# EAGLE design probe (EAGLE 9.6.2)
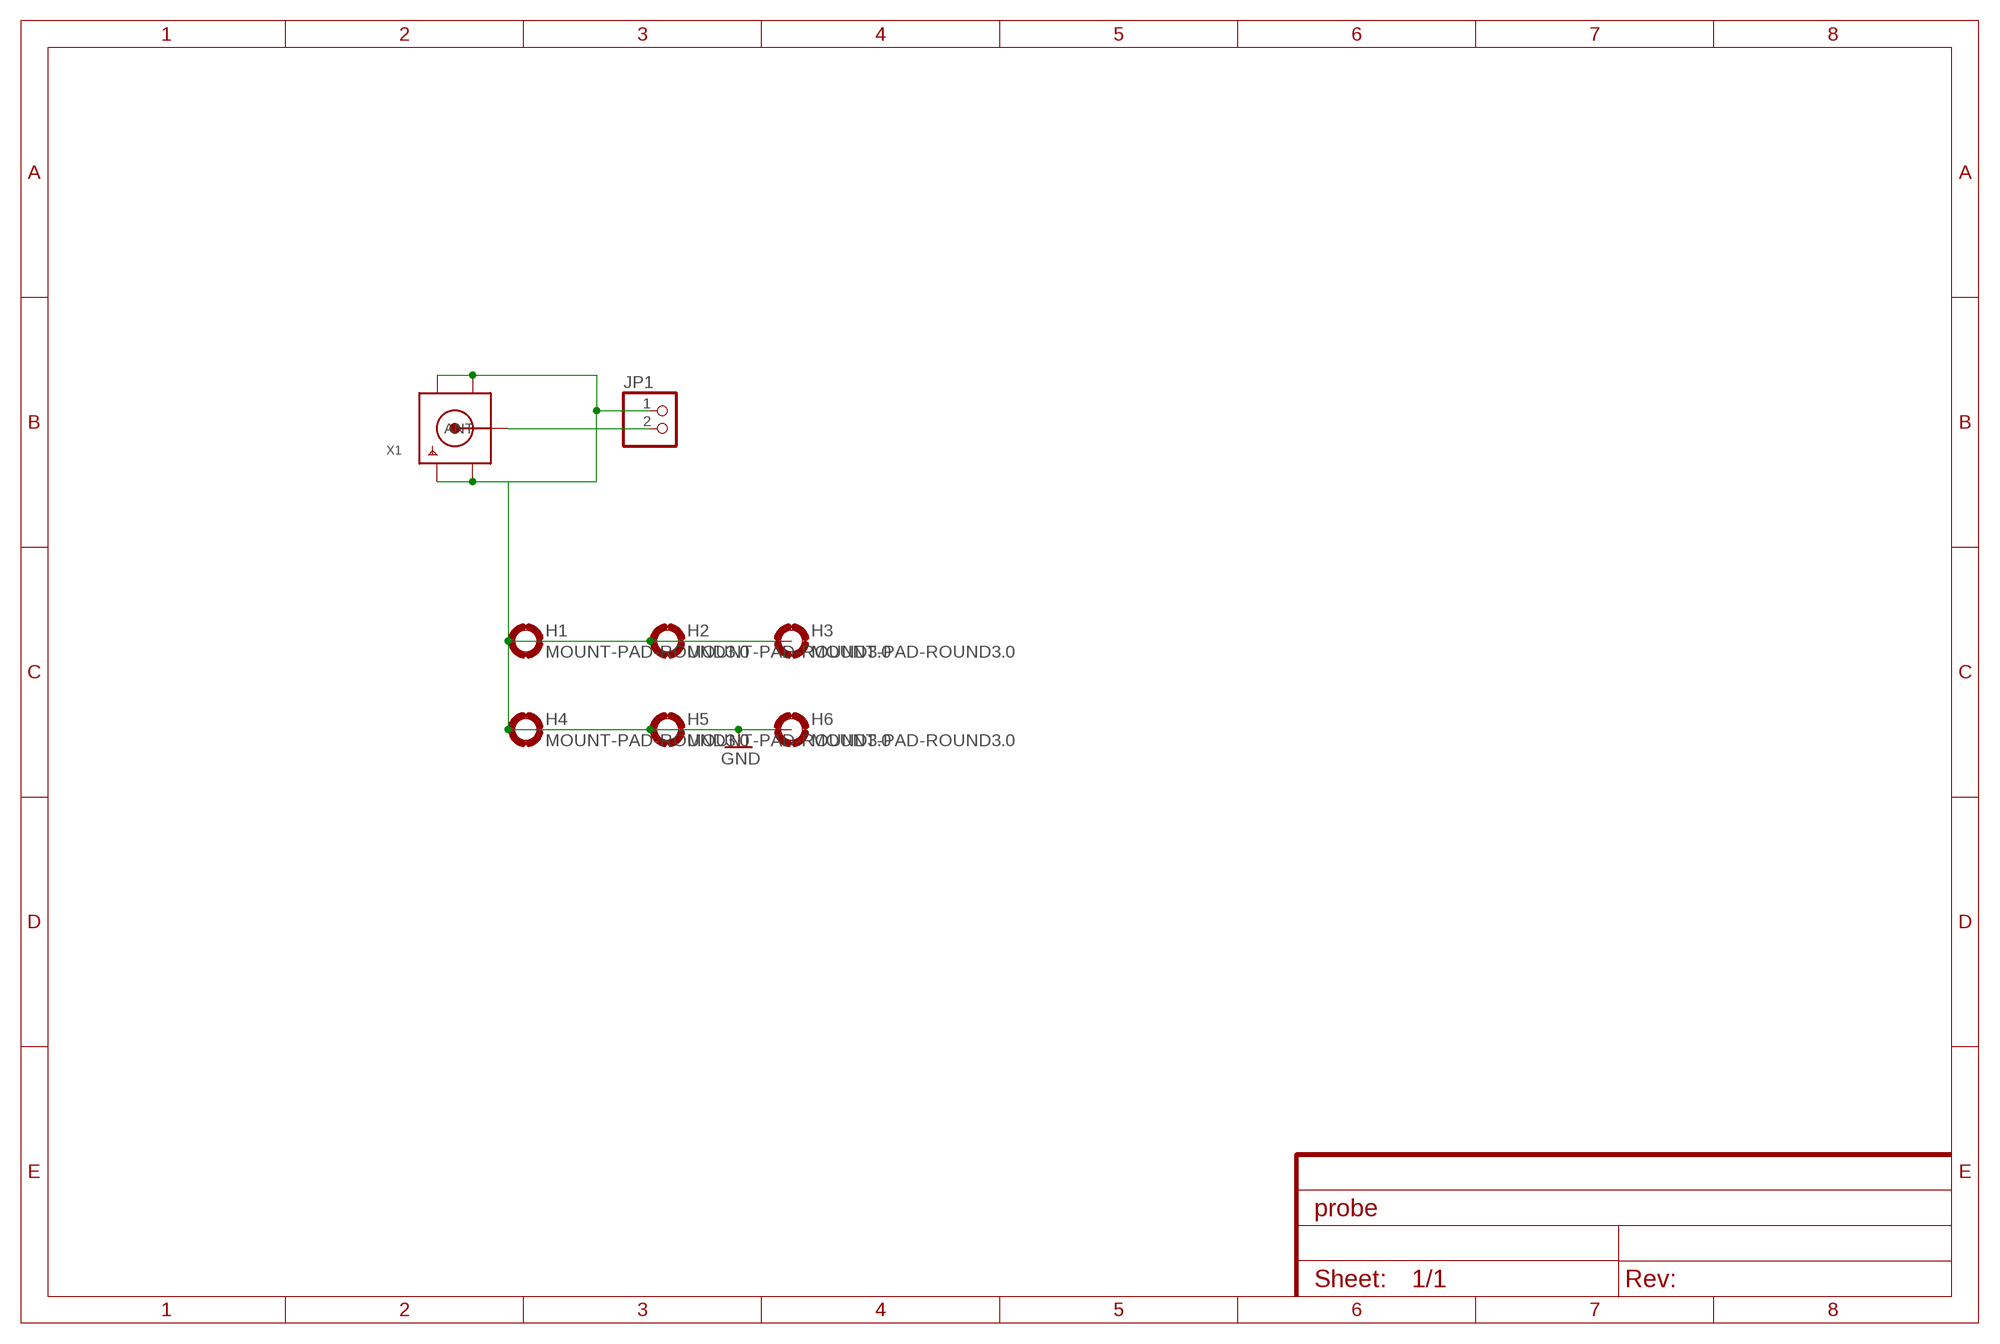
[diagram p0: schematic, sheet 1]

## Parts
H1  MOUNT-PAD-ROUND3.0  [3,0-PAD]
H2  MOUNT-PAD-ROUND3.0  [3,0-PAD]
H3  MOUNT-PAD-ROUND3.0  [3,0-PAD]
H4  MOUNT-PAD-ROUND3.0  [3,0-PAD]
H5  MOUNT-PAD-ROUND3.0  [3,0-PAD]
H6  MOUNT-PAD-ROUND3.0  [3,0-PAD]
JP1  TIP-1X2  [TIP-15]
X1  SMACONNECTOR_EDGE_UFL  [SMA_EDGELAUNCH_UFL]

## Nets
GND: H1.B3,0(MOUNT) H2.B3,0(MOUNT) H3.B3,0(MOUNT) H4.B3,0(MOUNT) H5.B3,0(MOUNT) H6.B3,0(MOUNT) JP1.1 X1.GND@1(GND1) X1.GND@2(GND2) X1.GND@3(GND3) X1.GND@4(GND4)
N$1: JP1.2 X1.P(ANT)

## Library data of the parts
H1-H6 = holes:MOUNT-PAD-ROUND: MOUNTING PAD, round
JP1 = lead:TIP-1X2: PIN HEADER
X1 = adafruit:SMACONNECTOR: SMA Connector 90° DIP SMA Connector, 50 Ohm (4UConnector: 07259)

## Board
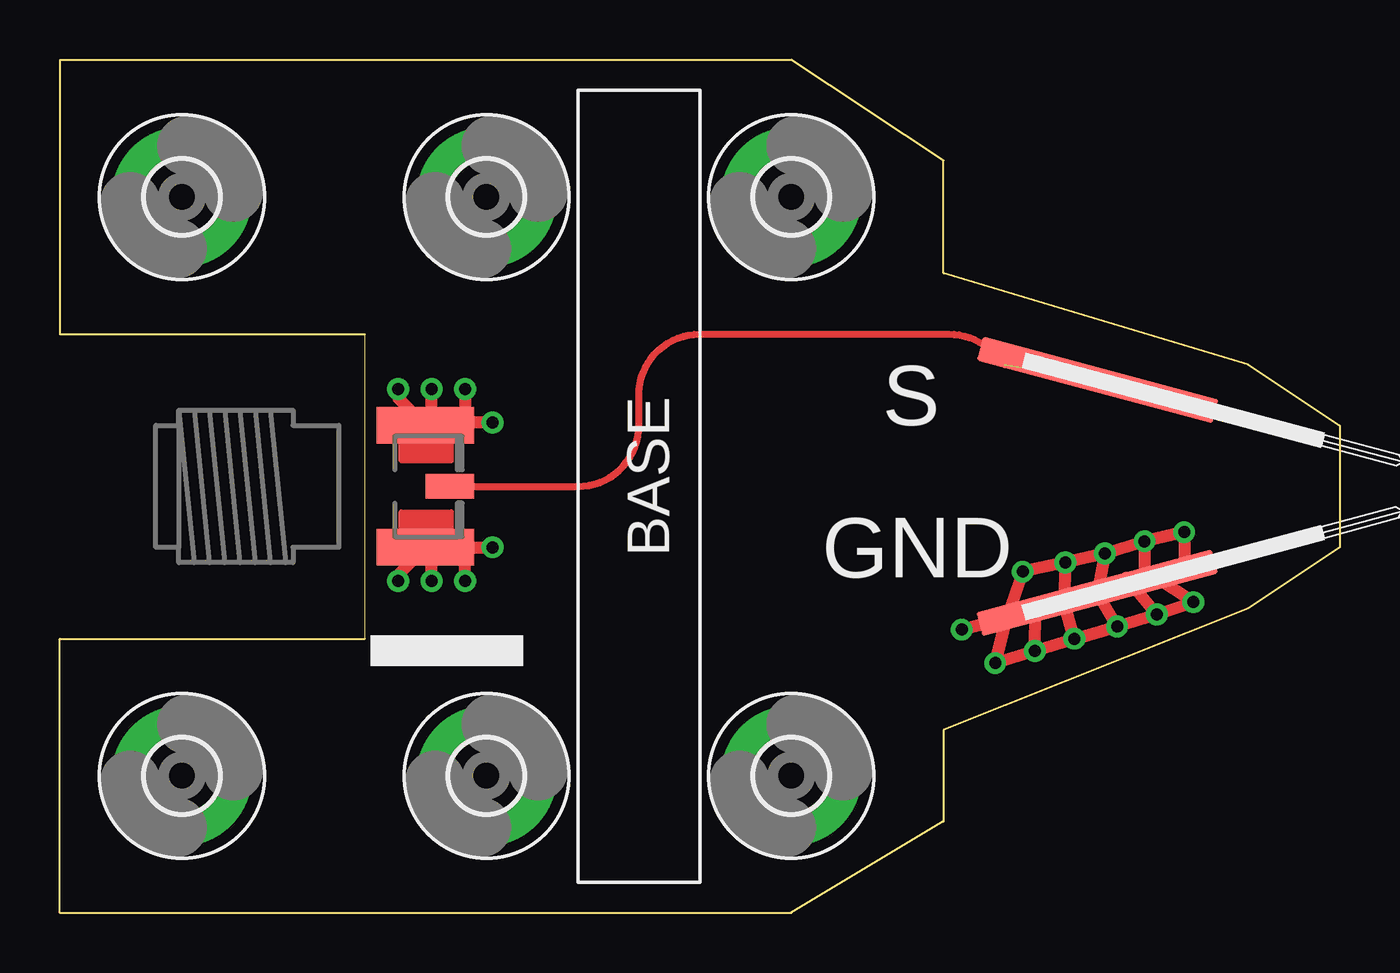
[diagram p1: board, top side]
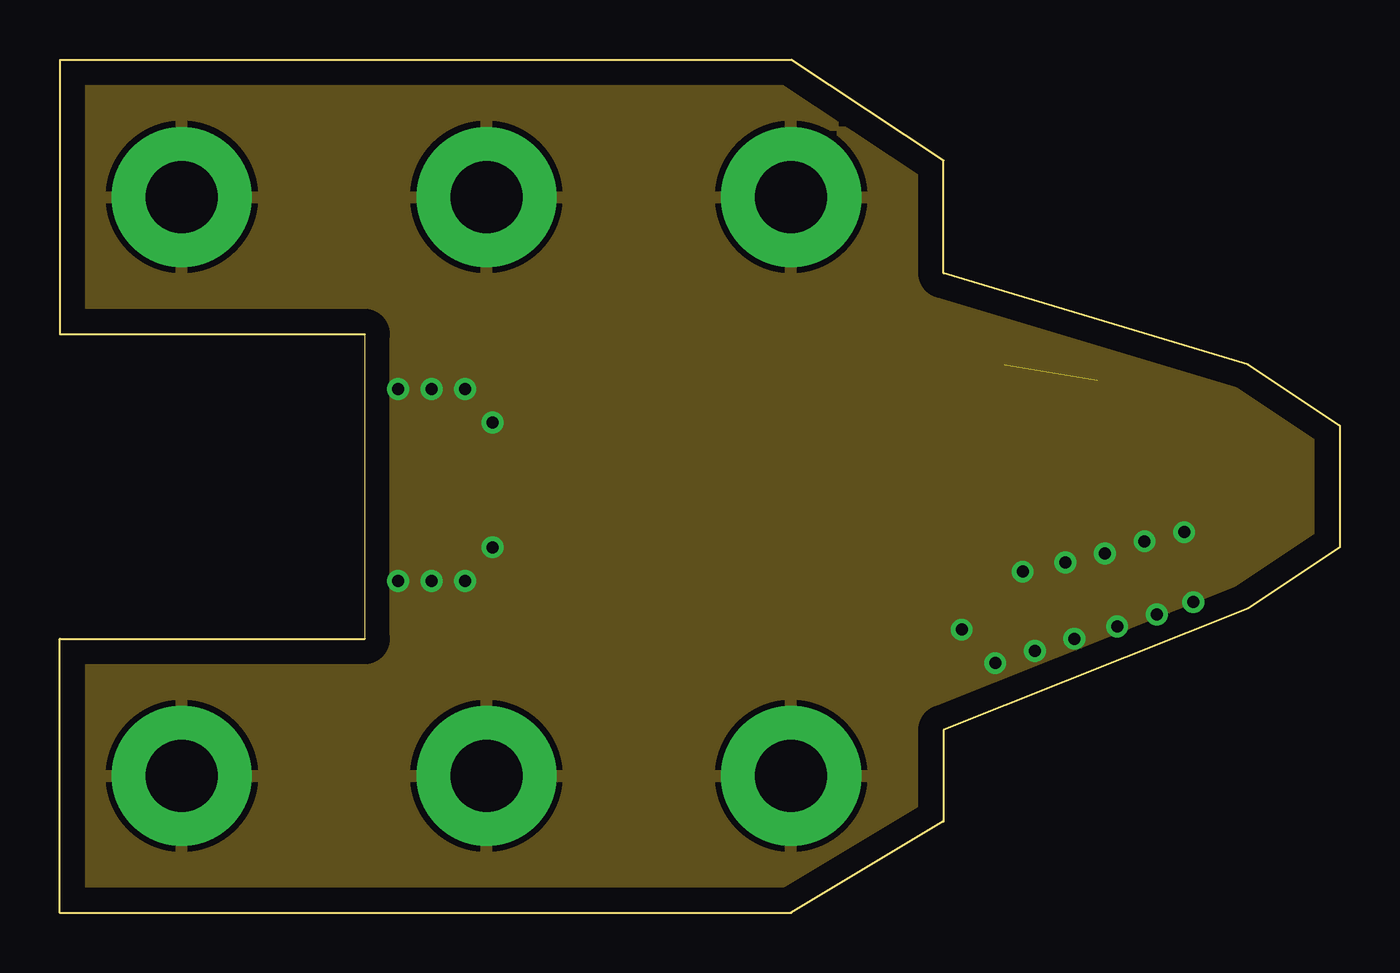
[diagram p2: board, inner layer Route2]
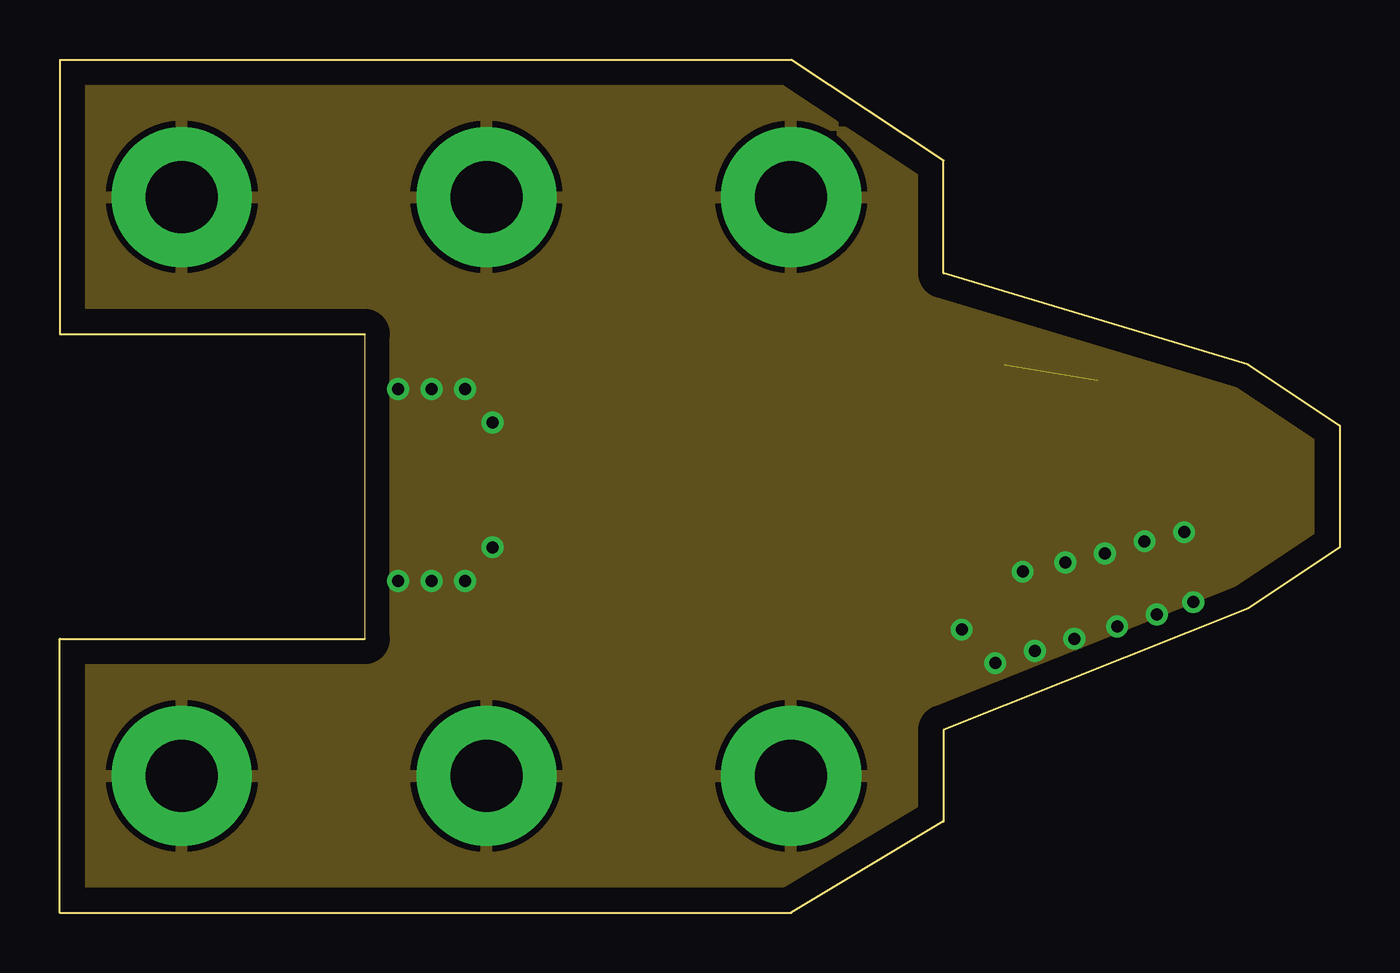
[diagram p3: board, inner layer Route15]
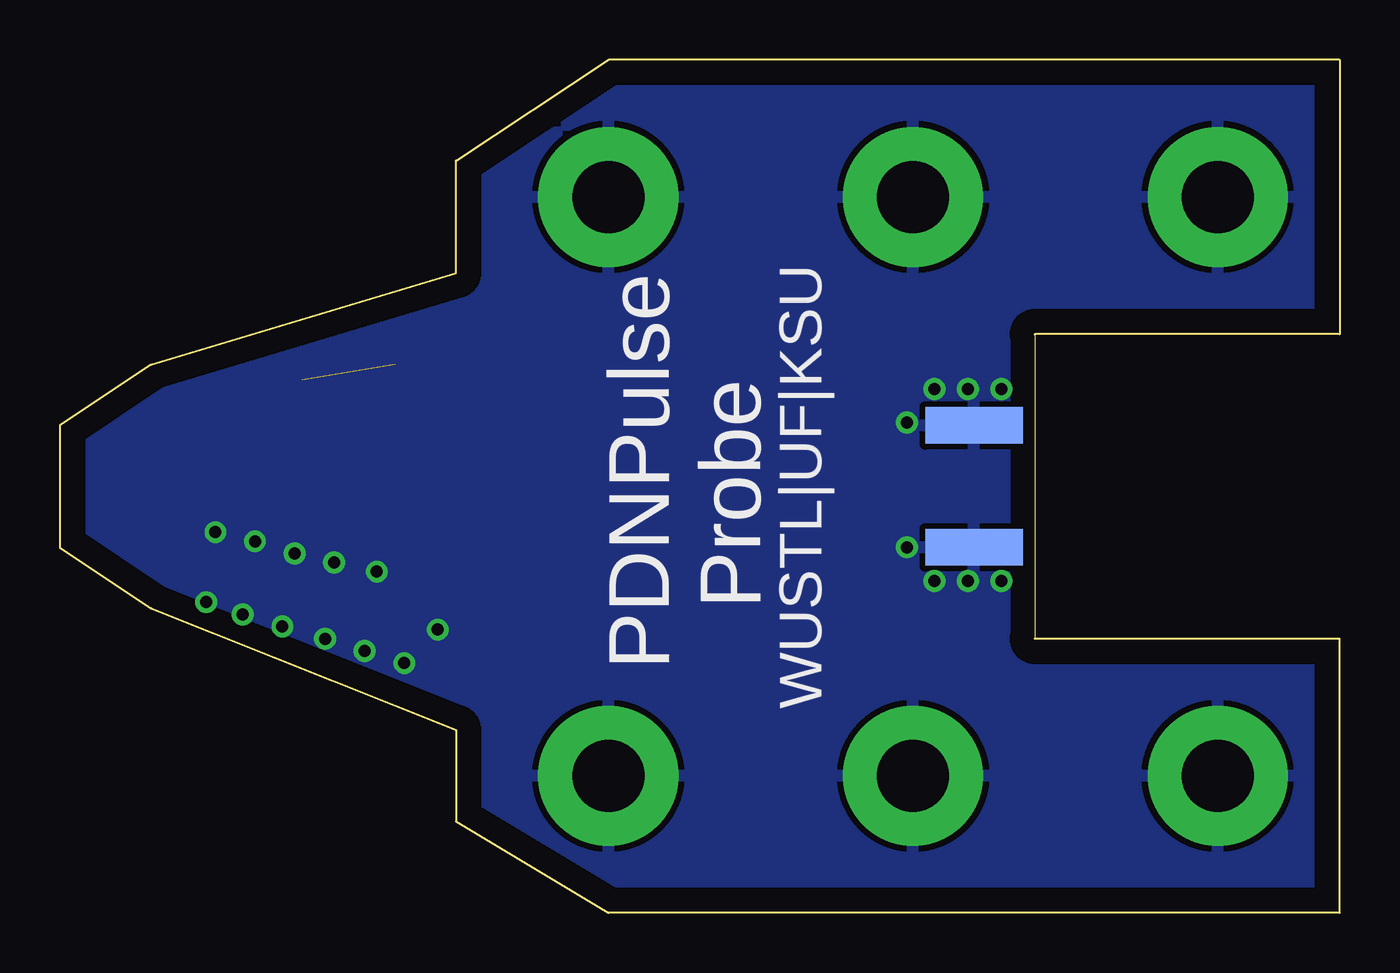
[diagram p4: board, bottom side, seen from below]

Size 53.34 x 35.56 mm. Coordinates in mm from the lower left corner, seen from the top.
Outline: 12.7,24.13 12.7,11.43 0,11.43 0,0 30.48,0 36.83,3.81 36.83,7.62 49.53,12.7 53.34,15.24 53.34,20.32 49.53,22.86 36.83,26.67 36.83,31.37 30.48,35.56 0,35.56 0,24.13 12.7,24.13
Copper layers (1+2*15+16): Top 0.035mm / dielectric 0.2mm / Route2 0.0175mm / dielectric 1.065mm / Route15 0.0175mm / dielectric 0.2mm / Bottom 0.035mm
Design rules "jlcpcb_4layer_7628 *": minimum track width 5mil, minimum drill 0.3mm, track to track 3.5mil, track to pad 0.2mm, pad to pad 5mil, via to via 0.54mm, smd to smd 0mil, copper to edge 0.4mm, drill to drill 0.54mm, minimum pad ring 12mil, minimum via ring 8mil, stop-mask expansion 2mil, vias tented up to drill 25mil, thermal gap 10mil

### Footprints (pad centres in the part's own frame; a part is rotated, then mirrored left to right if it is on the bottom)
3,0-PAD = drill 3 pad 5.842: B3,0 0,0
TIP-15 = smd 10.16 x 1.016 rotated 105: 1 -4.436,1.21 | smd 10.16 x 1.016 rotated 75: 2 4.439,1.197
SMA_EDGELAUNCH_UFL = smd 4.064 x 1.524: GND@1 2.032,-2.54; GND@2 2.032,2.54 | smd 4.064 x 1.524 bottom: GND@3 2.032,2.54; GND@4 2.032,-2.54 | smd 2.032 x 1.016: P 3.048,0

### Placement (x,y rotation side)
H1  5.08,29.84 0 top
H2  5.08,5.71 0 top
H3  17.78,5.71 0 top
H4  17.78,29.84 0 top
H5  30.48,29.84 0 top
H6  30.48,5.71 0 top
JP1  44.45,17.78 90 top
X1  13.21,17.78 0 top

### Tracks (layer width: path | path; a pad name or v marks a point on that pad's centre or on a via)
GND  (via drill 0.5)
  Top 0.508: v18.03,20.45 16.51,20.45 | 16.51,20.45 15.37,20.45 X1.GND@3 | v14.1,21.84 14.1,21.46 X1.GND@3 | X1.GND@3 15.49,20.57 v15.49,21.84 | v16.89,21.84 16.89,20.83 16.51,20.45 | v14.1,13.84 14.1,14.1 X1.GND@4 15.49,14.99 v15.49,13.84 | v18.03,15.24 16.51,15.24 16.89,14.86 v16.89,13.84 | v40.64,10.92 v38.99,10.41 39.47,12.32 | v40.64,10.92 v42.29,11.43 | v42.29,11.43 v44.07,11.94 | v44.07,11.94 v45.72,12.45 | v45.72,12.45 v47.24,12.95 45.72,13.97 | v45.21,15.49 v46.86,15.88 46.86,14.35 | v43.56,14.99 v45.21,15.49 | v43.56,14.99 v41.91,14.61 | v41.91,14.61 v40.13,14.22 39.47,12.32 | v37.59,11.81 39.47,12.32 | 39.47,12.32 40.66,12.64 | 40.66,12.64 41.84,12.96 | 41.84,12.96 JP1.1 | v44.07,11.94 JP1.1 | v42.29,11.43 41.84,12.96 | v40.64,10.92 40.66,12.64 | v45.72,12.45 44.45,13.97 | v41.91,14.61 41.84,12.96 | v43.56,14.99 JP1.1 | v45.21,15.49 45.21,13.97
  pour Bottom (isolate 1.016): -1.27,38.1 -1.27,-2.54 52.07,-2.54 52.07,38.1
  pour Route15 (isolate 1.016): -1.27,38.1 -1.27,-2.54 52.07,-2.54 52.07,38.1
  pour Route2 (isolate 1.016): -1.27,38.1 -1.27,-2.54 52.07,-2.54 52.07,38.1
N$1  (1 unrouted)
  Top 0.293: X1.P 21.59,17.78 arc90 24.13,20.32 24.13,21.59 arc-90 26.67,24.13 37.05,24.13 arc-45 38.84,23.39 39.37,22.86

### Text on the board
tPlace: S | BASE | GND
bPlace: Probe | PDNPulse | WUSTL|UF|KSU